# EAGLE design MCDU R (EAGLE 7.5.0)
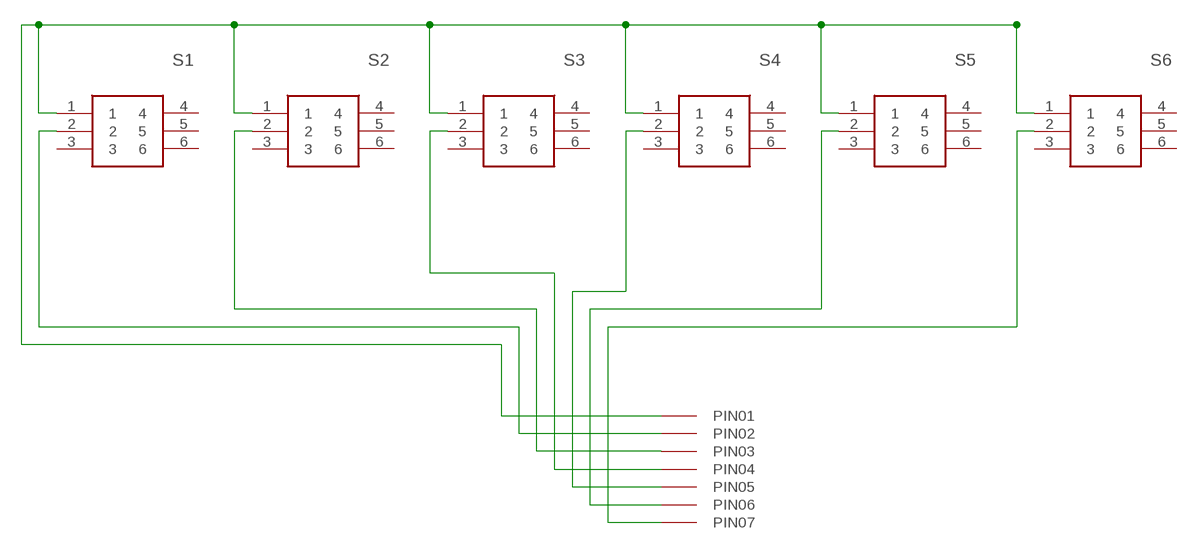
[diagram p0: schematic, sheet 1]

## Parts
S1  PVA2EEH1_1.7NV2  [PVA2]
S2  PVA2EEH1_1.7NV2  [PVA2]
S3  PVA2EEH1_1.7NV2  [PVA2]
S4  PVA2EEH1_1.7NV2  [PVA2]
S5  PVA2EEH1_1.7NV2  [PVA2]
S6  PVA2EEH1_1.7NV2  [PVA2]
U$1  07PINOS  [07PINOS]

## Nets
N$1: S1.1 S2.1 S3.1 S4.1 S5.1 S6.1 U$1.PIN01
N$3: S6.2 U$1.PIN07
N$4: S3.2 U$1.PIN04
N$92: S2.2 U$1.PIN03
N$94: S4.2 U$1.PIN05
N$95: S1.2 U$1.PIN02
N$96: S5.2 U$1.PIN06
Unconnected: S1.3 S1.4 S1.5 S1.6 S2.3 S2.4 S2.5 S2.6 S3.3 S3.4 S3.5 S3.6 S4.3 S4.4 S4.5 S4.6 S5.3 S5.4 S5.5 S5.6 S6.3 S6.4 S6.5 S6.6

## Library data of the parts
S1-S6 = PVA2EEH1_1.7NV2:PVA2EEH1_1.7NV2: Short Stroke Key Switches Source: Datasheet <http://www.ckswitches.com/media/1343/pva.pdf>; ARROW_PART_NUMBER: PVA2EEH1 1.7NV2; DESCRIPTION: Short Stroke Key Switches; HEIGHT: mm; MANUFACTURER_NAME: C & K COMPONENTS; MANUFACTURER_PART_NUMBER: PVA2EEH1 1.7NV2
U$1 = Arduino-clone:07PINOS: 07 pinos

## Board
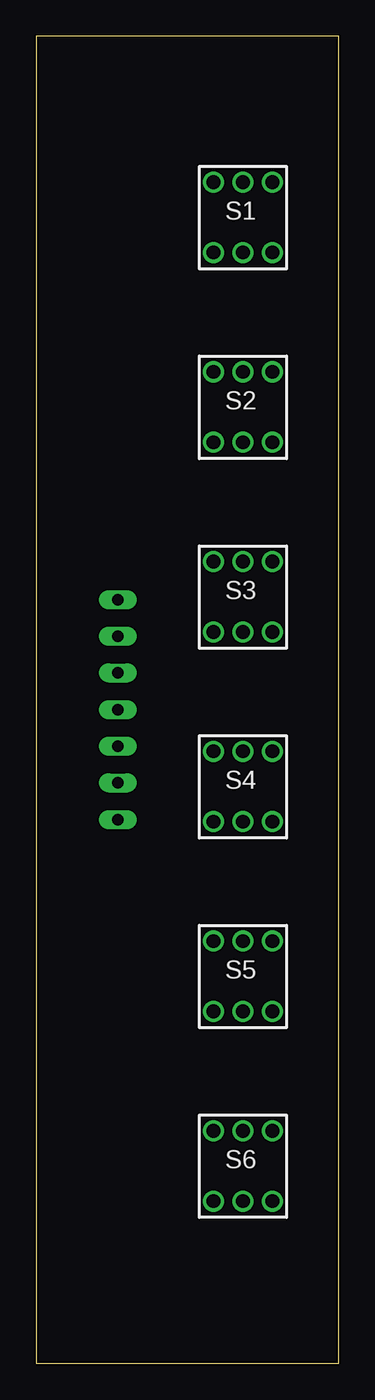
[diagram p1: board, top side]
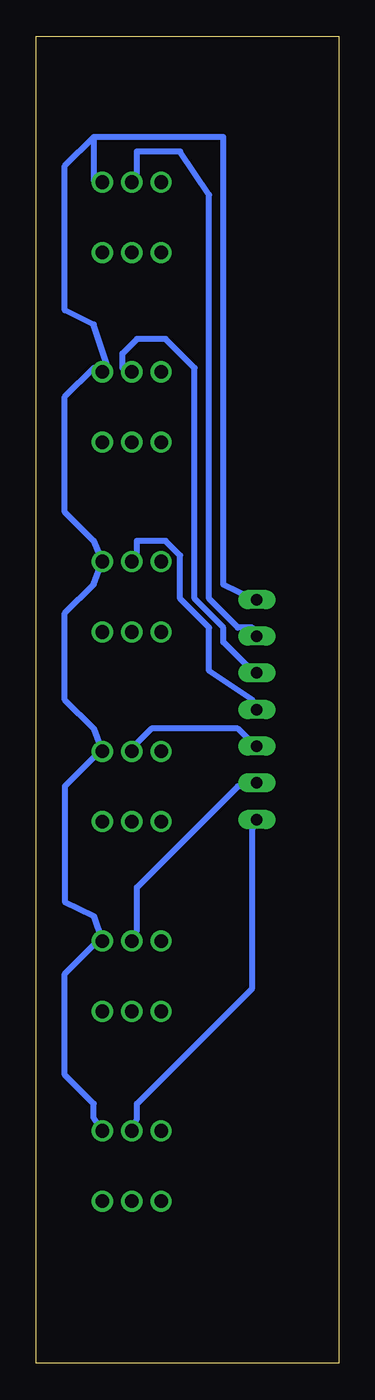
[diagram p2: board, bottom side, seen from below]

Size 21 x 92 mm. Coordinates in mm from the lower left corner, seen from the top.
Outline: 0,0 21,0 21,92 0,92 0,0
Copper layers (1*16): Top 0.035mm / dielectric 1.5mm / Bottom 0.035mm
Design rules "default": minimum track width 10mil, minimum drill 24mil, track to track 8mil, track to pad 8mil, pad to pad 8mil, via to via 8mil, smd to smd 8mil, copper to edge 40mil, drill to drill 8mil, minimum pad ring 10mil, minimum via ring 8mil, stop-mask expansion 4mil, vias tented up to drill 0mil, thermal gap 10mil

### Footprints (pad centres in the part's own frame; a part is rotated, then mirrored left to right if it is on the bottom)
PVA2 = drill 0.95 pad 1.45: 1 -2.398,-1.877; 2 -0.356,-1.877; 3 1.687,-1.877; 4 1.687,3; 5 -0.356,3; 6 -2.398,3
07PINOS = drill 0.8 long: PIN01 -6.35,26.67; PIN02 -6.35,24.13; PIN03 -6.35,21.59; PIN04 -6.35,19.05; PIN05 -6.35,16.51; PIN06 -6.35,13.97; PIN07 -6.35,11.43

### Placement (x,y rotation side)
S1  14,80 180 top
S2  14,66.85 180 top
S3  14,53.7 180 top
S4  14,40.55 180 top
S5  14,27.4 180 top
S6  14,14.25 180 top
U$1  12.03,26.27 0 top

### Tracks (layer width: path | path; a pad name or v marks a point on that pad's centre or on a via)
N$1
  Bottom 0.406: 17,85 8,85 8,54 6,53 U$1.PIN01 | 17,85 19,83 19,73 17,72 16,69 S2.1 17,69 19,67 19,59 17,57 S3.1 17,54 19,52 19,46 17,44 S4.1 17,42 19,40 19,32 17,31 S5.1 17,29 19,27 19,20 17,18 17,17 S6.1 | S1.1 17,82 17,85
N$3
  Bottom 0.406: S6.2 14,17 14,18 6,26 6,37 U$1.PIN07
N$4
  Bottom 0.406: U$1.PIN04 6,46 9,48 9,51 11,53 11,56 12,57 14,57 14,56 S3.2
N$92
  Bottom 0.406: U$1.PIN03 6,48 8,50 8,51 10,53 10,69 12,71 14,71 15,70 15,69 S2.2
N$94
  Bottom 0.406: U$1.PIN05 6,43 7,44 13,44 14,43 S4.2
N$95
  Bottom 0.406: U$1.PIN02 6,51 7,51 9,53 9,81 11,84 14,84 14,82 S1.2
N$96
  Bottom 0.406: U$1.PIN06 6,40 7,40 14,33 14,30 S5.2